# EAGLE schematic v1 (EAGLE 6.1)
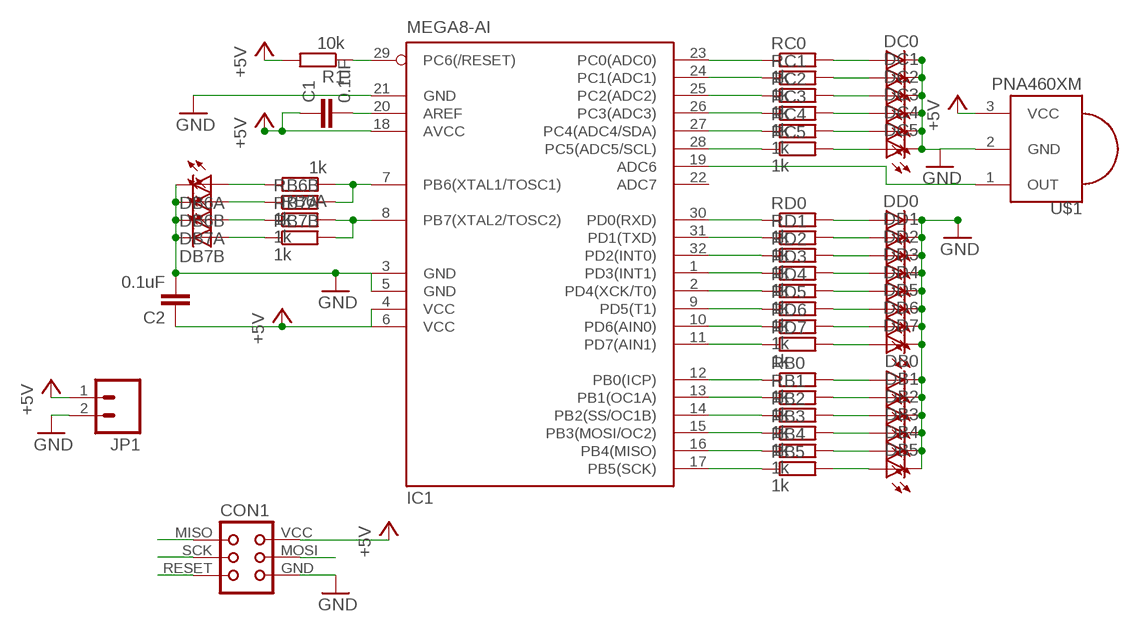
[diagram p0: schematic, sheet 1]

## Parts
C1  0.1uF  C-EUC1206  [C1206]
C2  0.1uF  C-EUC1206  [C1206]
CON1  TINYISP  [TINYISP]
DB0  LED3MM  [LED3MM]
DB1  LED3MM  [LED3MM]
DB2  LED3MM  [LED3MM]
DB3  LED3MM  [LED3MM]
DB4  LED3MM  [LED3MM]
DB5  LED3MM  [LED3MM]
DB6A  LED3MM  [LED3MM]
DB6B  LED3MM  [LED3MM]
DB7A  LED3MM  [LED3MM]
DB7B  LED3MM  [LED3MM]
DC0  LED3MM  [LED3MM]
DC1  LED3MM  [LED3MM]
DC2  LED3MM  [LED3MM]
DC3  LED3MM  [LED3MM]
DC4  LED3MM  [LED3MM]
DC5  LED3MM  [LED3MM]
DD0  LED3MM  [LED3MM]
DD1  LED3MM  [LED3MM]
DD2  LED3MM  [LED3MM]
DD3  LED3MM  [LED3MM]
DD4  LED3MM  [LED3MM]
DD5  LED3MM  [LED3MM]
DD6  LED3MM  [LED3MM]
DD7  LED3MM  [LED3MM]
IC1  MEGA8-AI  [TQFP32-08]
JP1  M023.5MM  [SCREWTERMINAL-3.5MM-2]
R1  10k  R-EU_M1206  [M1206]
RB0  1k  R-EU_M1206  [M1206]
RB1  1k  R-EU_M1206  [M1206]
RB2  1k  R-EU_M1206  [M1206]
RB3  1k  R-EU_M1206  [M1206]
RB4  1k  R-EU_M1206  [M1206]
RB5  1k  R-EU_M1206  [M1206]
RB6A  1k  R-EU_M1206  [M1206]
RB6B  1k  R-EU_M1206  [M1206]
RB7A  1k  R-EU_M1206  [M1206]
RB7B  1k  R-EU_M1206  [M1206]
RC0  1k  R-EU_M1206  [M1206]
RC1  1k  R-EU_M1206  [M1206]
RC2  1k  R-EU_M1206  [M1206]
RC3  1k  R-EU_M1206  [M1206]
RC4  1k  R-EU_M1206  [M1206]
RC5  1k  R-EU_M1206  [M1206]
RD0  1k  R-EU_M1206  [M1206]
RD1  1k  R-EU_M1206  [M1206]
RD2  1k  R-EU_M1206  [M1206]
RD3  1k  R-EU_M1206  [M1206]
RD4  1k  R-EU_M1206  [M1206]
RD5  1k  R-EU_M1206  [M1206]
RD6  1k  R-EU_M1206  [M1206]
RD7  1k  R-EU_M1206  [M1206]
U$1  PNA460XM  [PNA460XM]

## Nets
+5V [power]: C1.1 C2.1 CON1.VCC IC1.4(VCC) IC1.6(VCC) IC1.18(AVCC) JP1.1 R1.2 U$1.3(VCC)
GND [power]: C2.2 CON1.GND DB0.K(C) DB1.K(C) DB2.K(C) DB3.K(C) DB4.K(C) DB5.K(C) DB6A.K(C) DB6B.K(C) DB7A.K(C) DB7B.K(C) DC0.K(C) DC1.K(C) DC2.K(C) DC3.K(C) DC4.K(C) DC5.K(C) DD0.K(C) DD1.K(C) DD2.K(C) DD3.K(C) DD4.K(C) DD5.K(C) DD6.K(C) DD7.K(C) IC1.3(GND) IC1.5(GND) IC1.21(GND) JP1.2 U$1.2(GND)
MISO: CON1.MISO IC1.16(PB4(MISO)) RB4.1
MOSI: CON1.MOSI IC1.15(PB3(MOSI/OC2)) RB3.1
N$1: IC1.7(PB6(XTAL1/TOSC1)) RB6A.1 RB6B.2
N$2: IC1.24(PC1(ADC1)) RC1.1
N$3: IC1.23(PC0(ADC0)) RC0.1
N$4: C1.2 IC1.20(AREF)
N$5: IC1.26(PC3(ADC3)) RC3.1
N$6: IC1.25(PC2(ADC2)) RC2.1
N$7: IC1.27(PC4(ADC4/SDA)) RC4.1
N$8: IC1.28(PC5(ADC5/SCL)) RC5.1
N$9: IC1.30(PD0(RXD)) RD0.1
N$10: IC1.31(PD1(TXD)) RD1.1
N$11: IC1.1(PD3(INT1)) RD3.1
N$12: IC1.32(PD2(INT0)) RD2.1
N$13: IC1.9(PD5(T1)) RD5.1
N$14: IC1.2(PD4(XCK/T0)) RD4.1
N$15: IC1.10(PD6(AIN0)) RD6.1
N$16: IC1.11(PD7(AIN1)) RD7.1
N$17: IC1.12(PB0(ICP)) RB0.1
N$18: IC1.13(PB1(OC1A)) RB1.1
N$19: IC1.14(PB2(SS/OC1B)) RB2.1
N$21: IC1.8(PB7(XTAL2/TOSC2)) RB7A.2 RB7B.2
N$23: DB6B.A RB6B.1
N$24: DB7A.A RB7A.1
N$25: DC0.A RC0.2
N$26: DC1.A RC1.2
N$27: DC2.A RC2.2
N$28: DC3.A RC3.2
N$29: DC4.A RC4.2
N$30: DC5.A RC5.2
N$31: DD0.A RD0.2
N$32: DD1.A RD1.2
N$33: DD2.A RD2.2
N$34: DD3.A RD3.2
N$35: DD4.A RD4.2
N$36: DD5.A RD5.2
N$37: DD6.A RD6.2
N$38: DD7.A RD7.2
N$39: DB0.A RB0.2
N$40: DB1.A RB1.2
N$41: DB2.A RB2.2
N$42: DB3.A RB3.2
N$43: DB4.A RB4.2
N$44: DB6A.A RB6A.2
N$45: DB7B.A RB7B.1
N$46: DB5.A RB5.2
N$47: IC1.19(ADC6) U$1.1(OUT)
RESET: CON1.RESET IC1.29(PC6(/RESET)) R1.1
SCK: CON1.SCK IC1.17(PB5(SCK)) RB5.1
Unconnected: IC1.22(ADC7)

## Library data of the parts
C1 C2 = resistor:C-EU: CAPACITOR, European symbol
CON1 = lpatiny:TINYISP: CONNECTOR; OC_FARNELL: unknown; OC_NEWARK: unknown
DB0 DB1-DB5 DB6A DB6B DB7A DB7B DC0 DC1-DC5 DD0 DD1-DD7 = led:LED: LED OSRAM: - CHIPLED LG R971, LG N971, LY N971, LG Q971, LY Q971, LO R971, LY R971 LH N974, LH R974 LS Q976, LO Q976, LY Q976 LO Q996 - Hyper CHIPLED LW Q18S LB Q993, LB Q99A, LB R99A - SideLED LS A670, LO A670, LY A670, LG A670, LP A670 LB A673, LV A673, LT A673, LW A673 LH A674 LY A675 LS A676, LA A676, LO A676, LY A676, LW A676 LS A679, LY A679, LG A679 - Hyper Micro SIDELED® LS Y876, LA Y876, LO Y876, LY Y876 LT Y87S - SmartLED LW L88C, LW L88S LB L89C, LB L89S, LG L890 LS L89K, LO L89K, LY L89K LS L896, LA L896, LO L896, LY L896 - TOPLED LS T670, LO T670, LY T670, LG T670, LP T670 LSG T670, LSP T670, LSY T670, LOP T670, LYG T670 LG T671, LOG T671, LSG T671 LB T673, LV T673, LT T673, LW T673 LH T674 LS T676, LA T676, LO T676, LY T676, LB T676, LH T676, LSB T676, LW T676 LB T67C, LV T67C, LT T67C, LS T67K, LO T67K, LY T67K, LW E67C LS E67B, LA E67B, LO E67B, LY E67B, LB E67C, LV E67C, LT E67C LW T67C LS T679, LY T679, LG T679 LS T770, LO T770, LY T770, LG T770, LP T770 LB T773, LV T773, LT T773, LW T773 LH T774 LS E675, LA E675, LY E675, LS T675 LS T776, LA T776, LO T776, LY T776, LB T776 LHGB T686 LT T68C, LB T68C - Hyper Mini TOPLED® LB M676 - Mini TOPLED Santana® LG M470 LS M47K, LO M47K, LY M47K Source: http://www.osram.convergy.de LUXEON: - LUMILED® LXK2-PW12-R00, LXK2-PW12-S00, LXK2-PW14-U00, LXK2-PW14-V00 LXK2-PM12-R00, LXK2-PM12-S00, LXK2-PM14-U00 LXK2-PE12-Q00, LXK2-PE12-R00, LXK2-PE12-S00, LXK2-PE14-T00, LXK2-PE14-U00 LXK2-PB12-K00, LXK2-PB12-L00, LXK2-PB12-M00, LXK2-PB14-N00, LXK2-PB14-P00, LXK2-PB14-Q00 LXK2-PR12-L00, LXK2-PR12-M00, LXK2-PR14-Q00, LXK2-PR14-R00 LXK2-PD12-Q00, LXK2-PD12-R00, LXK2-PD12-S00 LXK2-PH12-R00, LXK2-PH12-S00 LXK2-PL12-P00, LXK2-PL12-Q00, LXK2-PL12-R00 Source: www.luxeon.com KINGBRIGHT: KA-3528ASYC Source: www.kingbright.com
IC1 = atmel:MEGA8: MICROCONTROLLER 8 Kbytes FLASH, 1 kbytes SRAM, 512 bytes EEPROM, USART, 6-channel 10 bit ADC, 2-channel 8 bit ADC Pin compatible with Atmega48, ATMega88, ATMega168 Source: avr.lbr; MPN: ATMEGA8-16AU; OC_FARNELL: 9171371; OC_NEWARK: 73M8863
JP1 = SparkFun:M02: Header 2 Standard 2-pin 0.1" header. Use with straight break away headers (SKU : PRT-00116), right angle break away headers (PRT-00553), swiss pins (PRT-00743), machine pins (PRT-00117), and female headers (PRT-00115). Molex polarized connector foot print use with SKU : PRT-08233 with associated crimp pins and housings.
R1 RB0 RB1-RB5 RB6A RB6B RB7A RB7B RC0 RC1-RC5 RD0 RD1-RD7 = resistor:R-EU_: RESISTOR, European symbol
U$1 = adafruit:PNA460XM: IR 38KHz receiver PNA4602 and related receivers http://www.ladyada.net/library/pcb/eaglelibrary.html

## Net classes
1 power: width 0.406 mm